# EAGLE design reverb (EAGLE 7.5.0)

## Sheet 1 of 3: Power
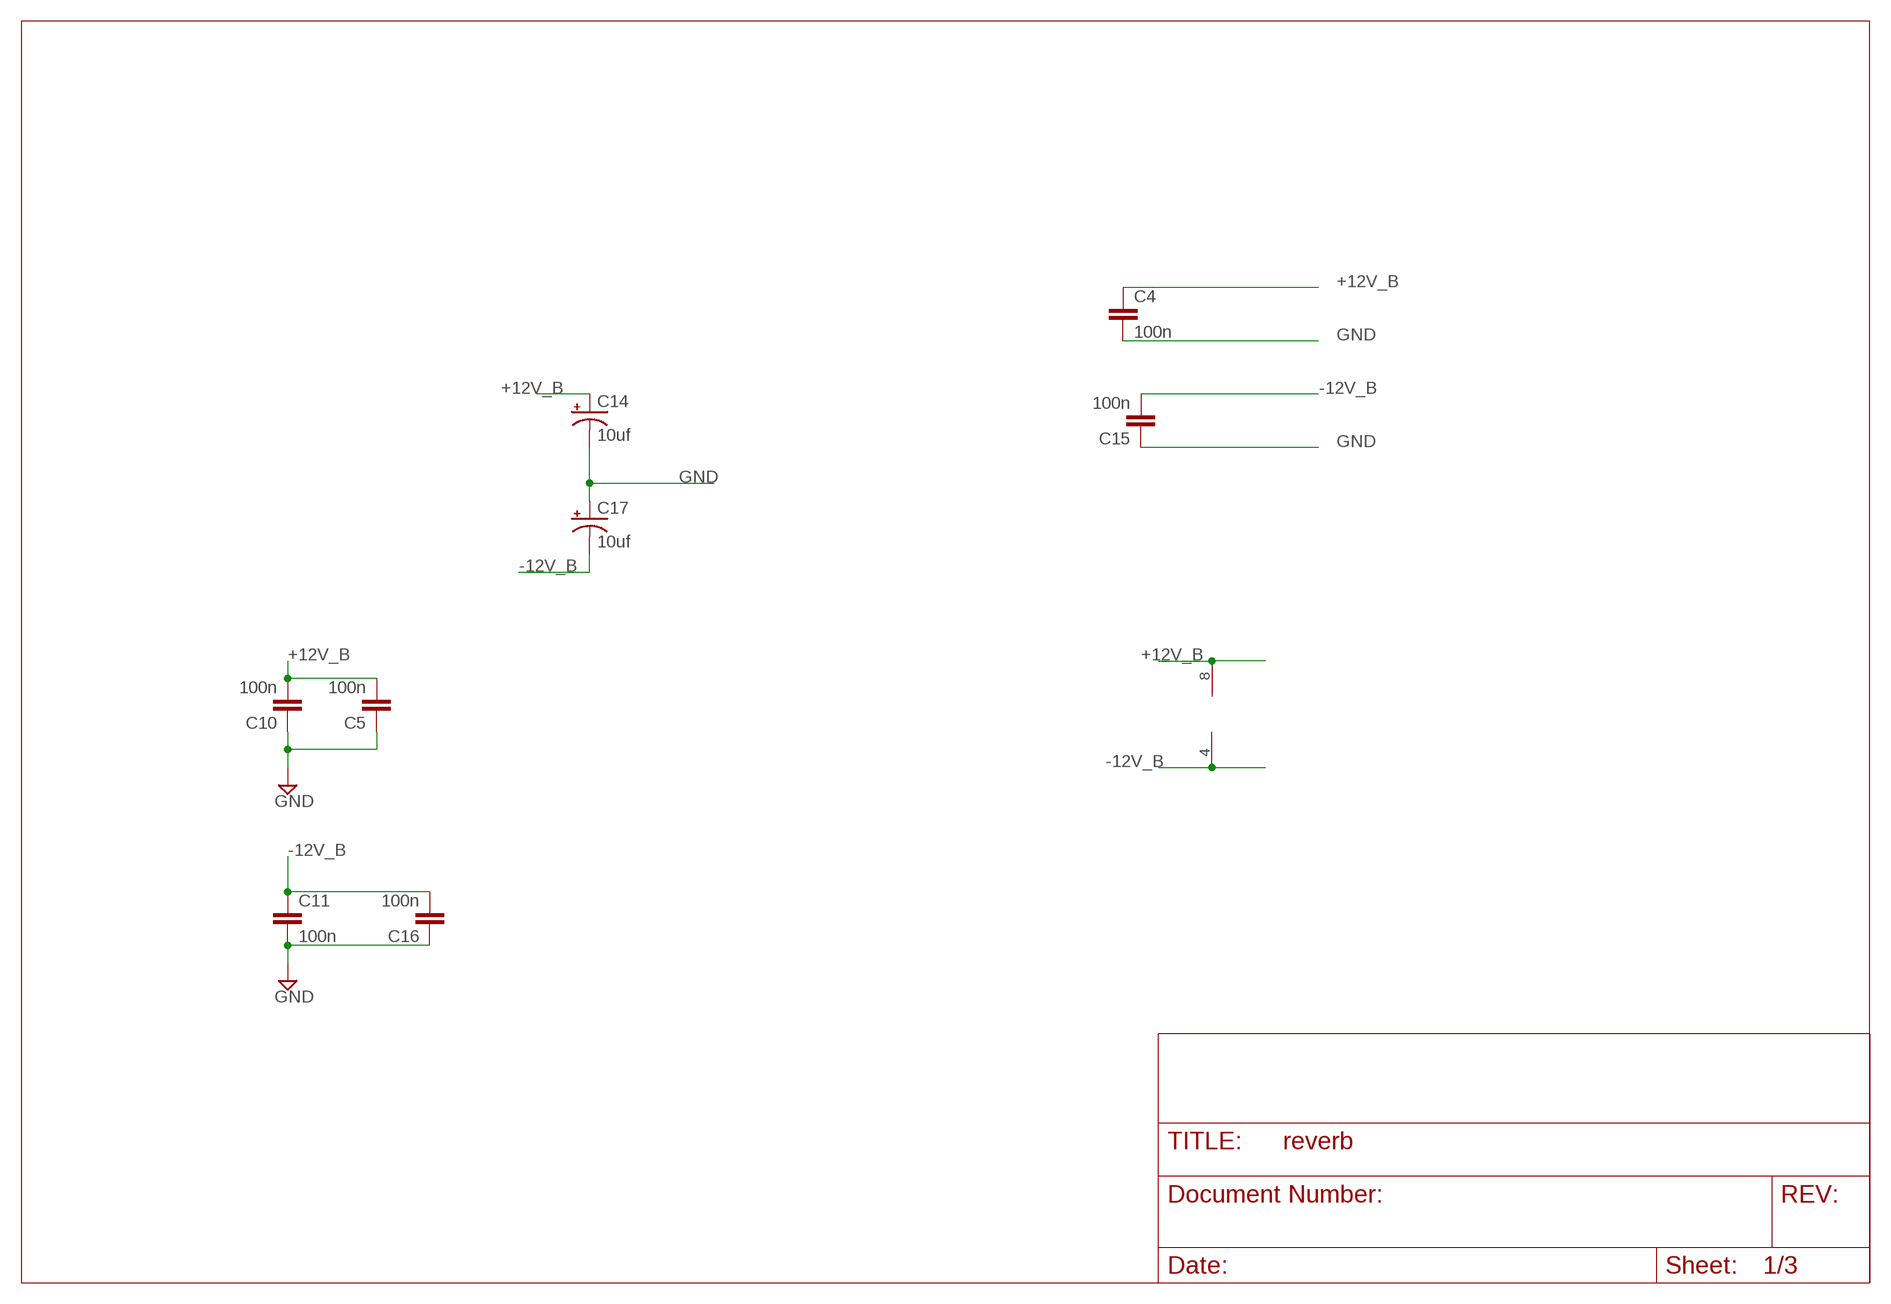
[diagram p0: schematic, sheet 1]

### Parts
C4  100n  C-EU050-024X044  [C050-024X044]
C5  100n  C-EU050-024X044  [C050-024X044]
C10  100n  C-EU050-024X044  [C050-024X044]
C11  100n  C-EU050-024X044  [C050-024X044]
C14  10uf  CAP_POLPTH2  [CPOL-RADIAL-10UF-25V]
C15  100n  C-EU050-024X044  [C050-024X044]
C16  100n  C-EU050-024X044  [C050-024X044]
C17  10uf  CAP_POLPTH2  [CPOL-RADIAL-10UF-25V]
IC4_DRV_RCVR  TL072  TL072P  [DIL08]

### Nets
+12V_B [power]: C4.1 C5.2 C10.2 C14.1(+) IC4_DRV_RCVR.8(P:V+) ; also sheet 2,3
-12V_B [power]: C11.1 C15.2 C16.2 C17.2(-) IC4_DRV_RCVR.4(P:V-) ; also sheet 2,3
GND [ground]: C4.2 C5.1 C10.1 C11.2 C14.2(-) C15.1 C16.1 C17.1(+) ; also sheet 2,3

## Sheet 2 of 3
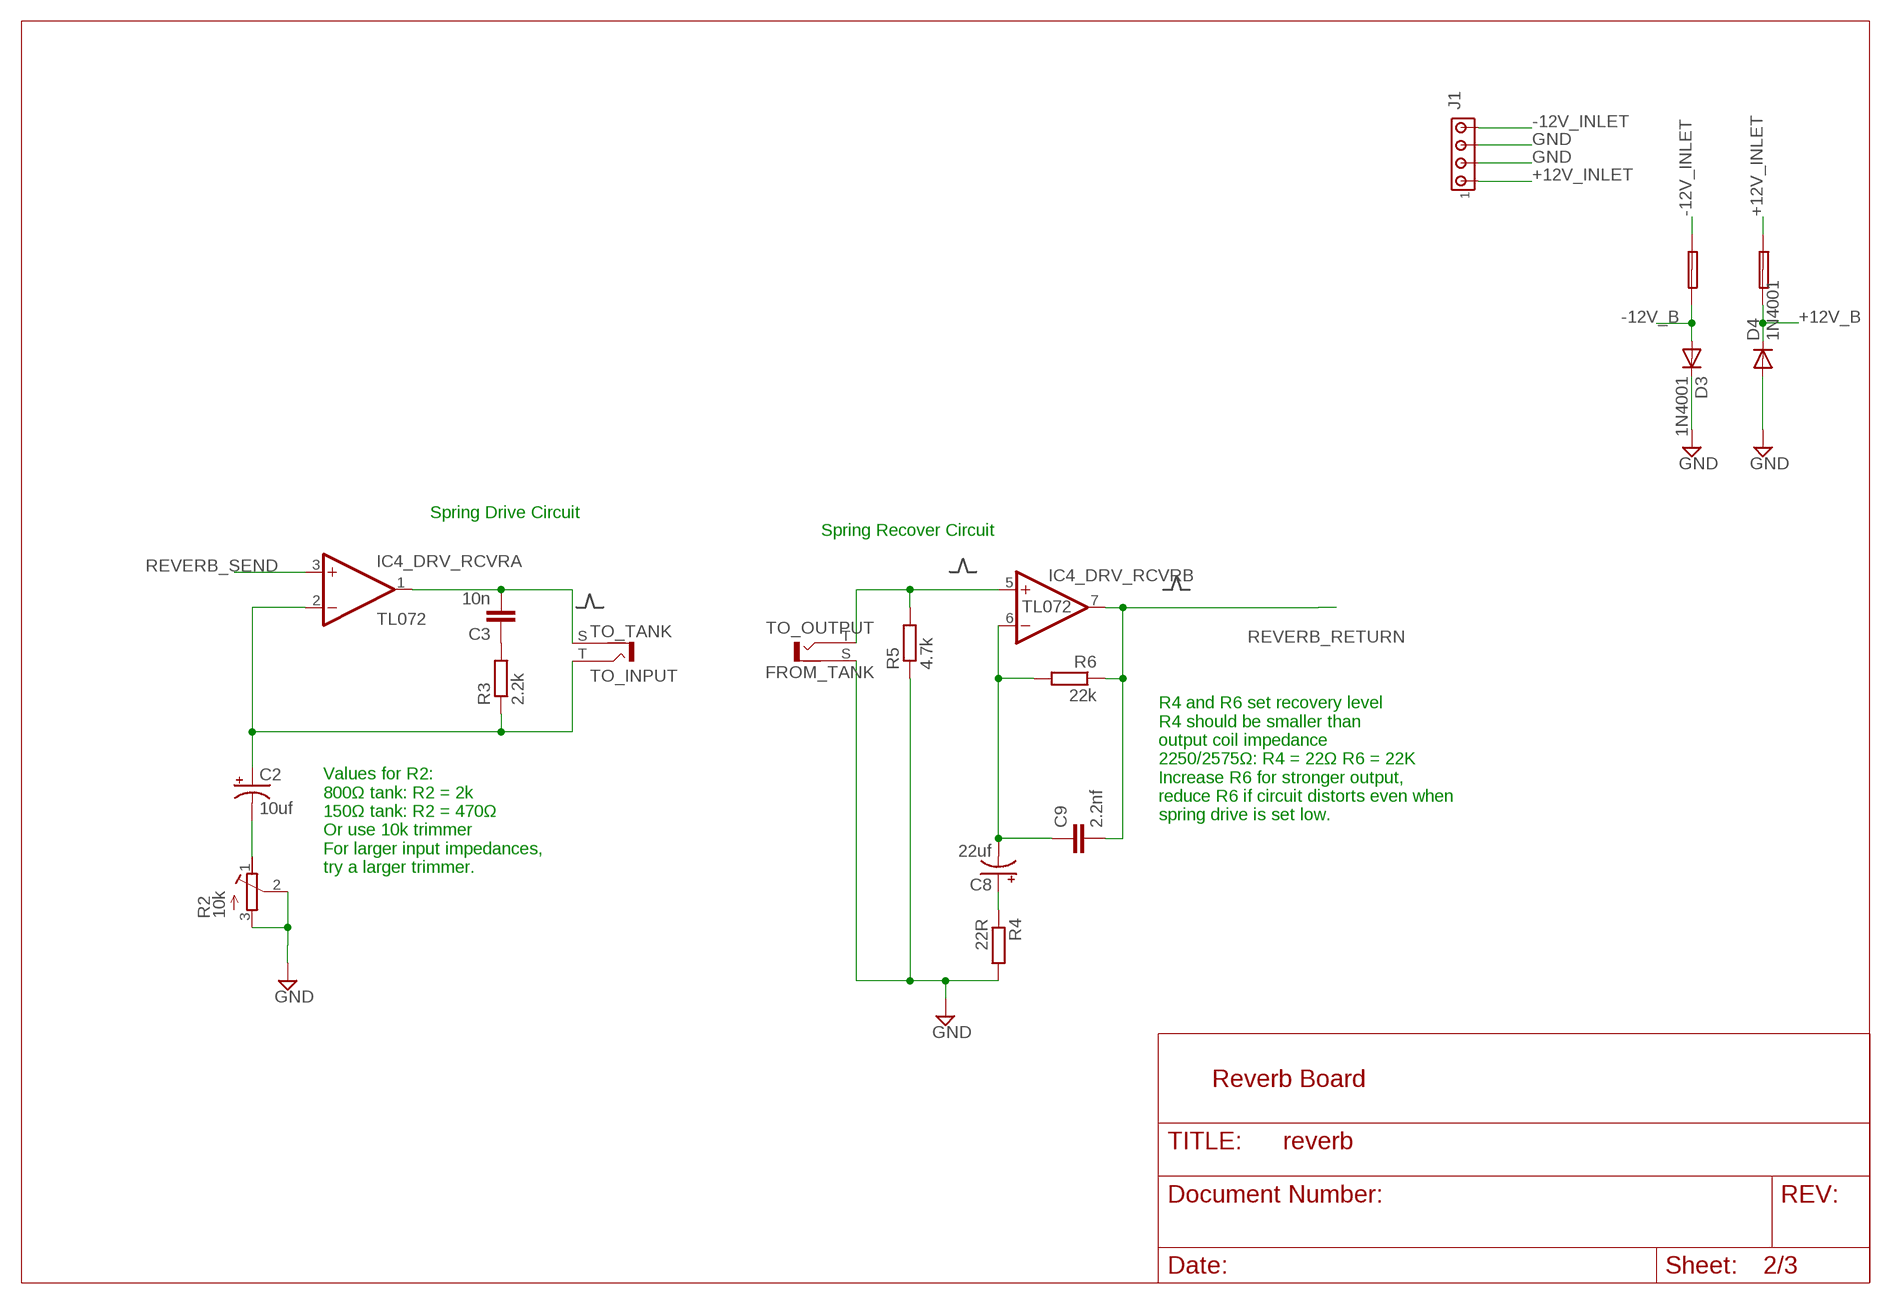
[diagram p1: schematic, sheet 2]

### Parts
0.1A_FUSE  FUSE  PTC_FUSEPOLY_FUSE  [C050H075X075]
0.1A_FUSE_2  FUSE  PTC_FUSEPOLY_FUSE  [C050H075X075]
C2  10uf  CAP_POLPTH2  [CPOL-RADIAL-10UF-25V]
C3  10n  C-EU050-024X044  [C050-024X044]
C8  22uf  CAP_POLPTH2  [CPOL-RADIAL-10UF-25V]
C9  2.2nf  C-EU050-024X044  [C050-024X044]
D3  1N4001  1N4004  [DO41-10]
D4  1N4001  1N4004  [DO41-10]
J1  MTA04-156  [1X4MTA]
R2  10k  R-TRIMMT93YA  [RTRIMT93YA]
R3  2.2k  R-EU_STANDARD_RESISTOR  [0207/10]
R4  22R  R-EU_STANDARD_RESISTOR  [0207/10]
R5  4.7k  R-EU_STANDARD_RESISTOR  [0207/10]
R6  22k  R-EU_STANDARD_RESISTOR  [0207/10]
TO_INPUT  TO_TANK  BTOR1  [BTOR1]
TO_OUTPUT  FROM_TANK  BTOR1  [BTOR1]

### Nets
+12V_B [power]: 0.1A_FUSE_2.1 D4.C ; also sheet 1,3
+12V_INLET: 0.1A_FUSE_2.2 J1.1
-12V_B [power]: 0.1A_FUSE.1 D3.A ; also sheet 1,3
-12V_INLET: 0.1A_FUSE.2 J1.4
GND [ground]: D3.C D4.A J1.2 J1.3 R2.2(S) R2.3(E) R4.2 R5.1 TO_OUTPUT.S ; also sheet 1,3
N$1: C2.2(-) R2.1(A)
N$2: C3.1 R3.2
N$4: C3.2 IC4_DRV_RCVR.1(A:OUT) TO_INPUT.S
N$5: C2.1(+) IC4_DRV_RCVR.2(A:-IN) R3.1 TO_INPUT.T
N$7: IC4_DRV_RCVR.5(B:+IN) R5.2 TO_OUTPUT.T
N$8: C8.1(+) R4.1
N$9: C8.2(-) C9.1 IC4_DRV_RCVR.6(B:-IN) R6.2
REVERB_RETURN: C9.2 IC4_DRV_RCVR.7(B:OUT) R6.1 ; also sheet 3
REVERB_SEND: IC4_DRV_RCVR.3(A:+IN) ; also sheet 3
Unconnected: TO_INPUT.S@1 TO_INPUT.S@2 TO_INPUT.S@3 TO_OUTPUT.S@1 TO_OUTPUT.S@2 TO_OUTPUT.S@3

### Notes on the sheet
- Spring Drive Circuit
- Spring Recover Circuit
- Values for R2:
  800Ω tank: R2 = 2k
  150Ω tank: R2 = 470Ω
  Or use 10k trimmer
  For larger input impedances, 
  try a larger trimmer.
- R4 and R6 set recovery level 
  R4 should be smaller than 
  output coil impedance
  2250/2575Ω: R4 = 22Ω R6 = 22K 
  Increase R6 for stronger output, 
  reduce R6 if circuit distorts even when 
  spring drive is set low.
- Reverb Board

## Sheet 3 of 3
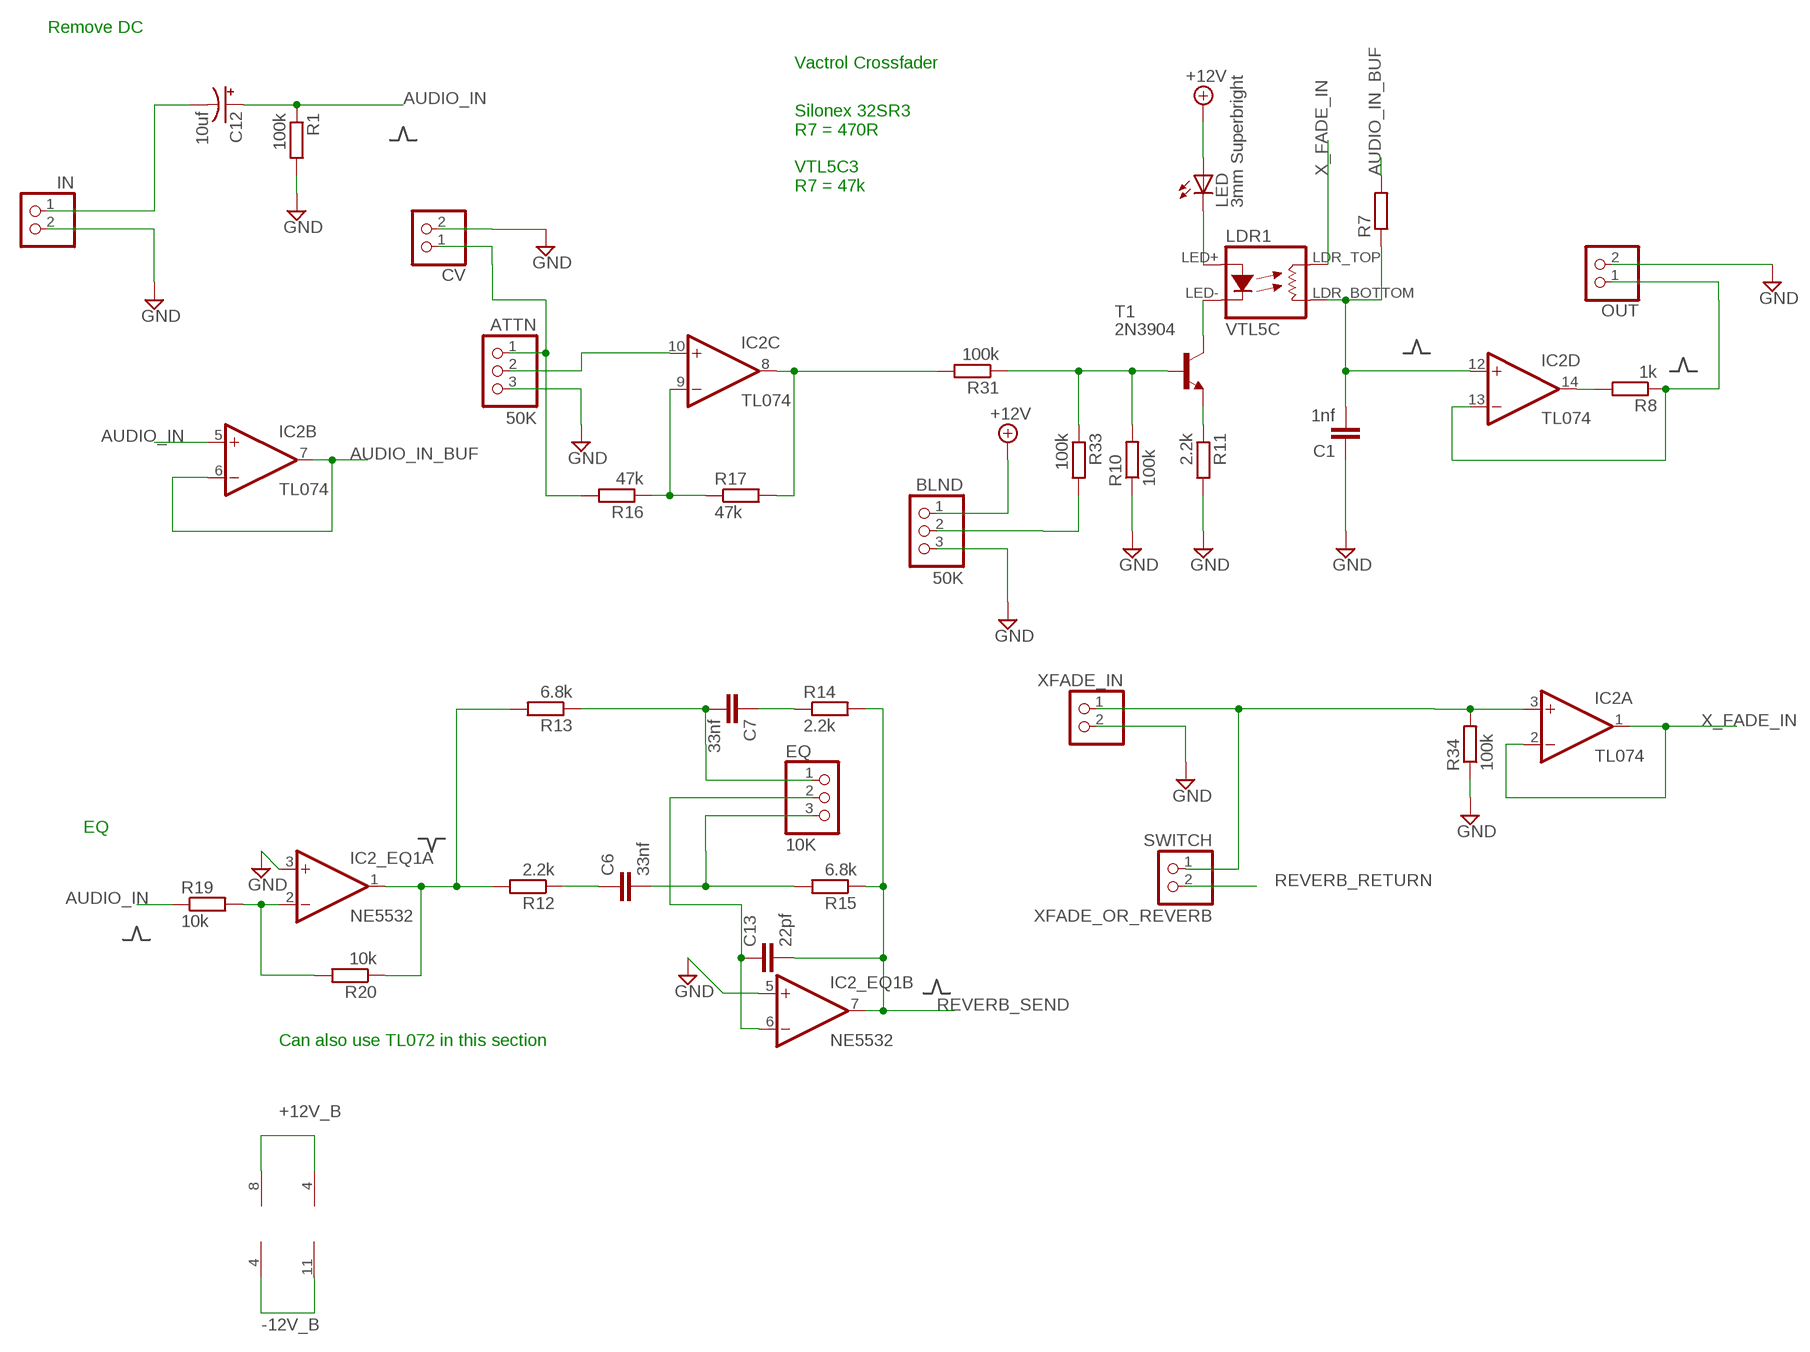
[diagram p2: schematic, sheet 3]

### Parts
ATTN  50K  PINHD-1X3  [1X03]
BLND  50K  PINHD-1X3  [1X03]
C1  1nf  C-EU050-024X044  [C050-024X044]
C6  33nf  C-EU050-024X044  [C050-024X044]
C7  33nf  C-EU050-024X044  [C050-024X044]
C12  10uf  050  [050_020]
C13  22pf  050X030_0251  [050X030_025]
CV  PINHD-1X2  [1X02]
EQ  10K  PINHD-1X3  [1X03]
IC2  TL074  TL074P  [DIL14]
IC2_EQ1  NE5532  TL072P  [DIL08]
IN  PINHD-1X2  [1X02]
LDR1  VTL5C  VACTROL_COMPACT  [VACTROL_COMPACT]
LED  3mm Superbright  LED3MM  [LED3MM]
OUT  PINHD-1X2  [1X02]
R1  100k  VERT-RESIST1  [VERT-RESISTOR]
R7  R-EU_STANDARD_RESISTOR  [0207/10]
R8  1k  R-EU_STANDARD_RESISTOR  [0207/10]
R10  100k  R-EU_STANDARD_RESISTOR  [0207/10]
R11  2.2k  R-EU_STANDARD_RESISTOR  [0207/10]
R12  2.2k  R-EU_STANDARD_RESISTOR  [0207/10]
R13  6.8k  R-EU_STANDARD_RESISTOR  [0207/10]
R14  2.2k  R-EU_STANDARD_RESISTOR  [0207/10]
R15  6.8k  R-EU_STANDARD_RESISTOR  [0207/10]
R16  47k  VERT-RESIST1  [VERT-RESISTOR]
R17  47k  VERT-RESIST1  [VERT-RESISTOR]
R19  10k  VERT-RESIST1  [VERT-RESISTOR]
R20  10k  R-EU_STANDARD_RESISTOR  [0207/10]
R31  100k  R-EU_STANDARD_RESISTOR  [0207/10]
R33  100k  R-EU_STANDARD_RESISTOR  [0207/10]
R34  100k  R-EU_STANDARD_RESISTOR  [0207/10]
SWITCH  XFADE_OR_REVERB  PINHD-1X2  [1X02]
T1  2N3904  [TO92]
XFADE_IN  PINHD-1X2  [1X02]

### Nets
+12V [power]: BLND.1 LED.A
+12V_B [power]: IC2.4(P:V+) IC2_EQ1.8(P:V+) ; also sheet 1,2
-12V_B [power]: IC2.11(P:V-) IC2_EQ1.4(P:V-) ; also sheet 1,2
AUDIO_IN: C12.+ IC2.5(B:+IN) R1.1 R19.1
AUDIO_IN_BUF: IC2.6(B:-IN) IC2.7(B:OUT) R7.2
GND [ground]: ATTN.3 BLND.3 C1.1 CV.2 IC2_EQ1.3(A:+IN) IC2_EQ1.5(B:+IN) IN.2 OUT.2 R1.2 R10.1 R11.2 R34.1 XFADE_IN.2 ; also sheet 1,2
MIX_OUT_B: IC2.13(D:-IN) OUT.1 R8.1
N$3: C12.- IN.1
N$6: IC2.3(A:+IN) R34.2 SWITCH.1 XFADE_IN.1
N$10: ATTN.1 CV.1 R16.2
N$13: C6.1 R12.1
N$14: BLND.2 R33.2
N$15: IC2.14(D:OUT) R8.2
N$16: C6.2 EQ.3 R15.2
N$17: R11.1 T1.3(E)
N$18: C7.2 EQ.1 R13.1
N$20: ATTN.2 IC2.10(C:+IN)
N$21: C7.1 R14.1
N$22: C13.1 EQ.2 IC2_EQ1.6(B:-IN)
N$23: IC2.9(C:-IN) R16.1 R17.1
N$24: IC2_EQ1.2(A:-IN) R19.2 R20.2
N$25: IC2.8(C:OUT) R17.2 R31.2
N$26: LDR1.LED+ LED.K(C)
N$31: IC2_EQ1.1(A:OUT) R12.2 R13.2 R20.1
N$36: R10.2 R31.1 R33.1 T1.2(B)
N$37: LDR1.LED- T1.1(C)
REVERB_RETURN: SWITCH.2 ; also sheet 2
REVERB_SEND: C13.2 IC2_EQ1.7(B:OUT) R14.2 R15.1 ; also sheet 2
SUM: C1.2 IC2.12(D:+IN) LDR1.LDR_BOTTOM(RES2) R7.1
X_FADE_IN: IC2.1(A:OUT) IC2.2(A:-IN) LDR1.LDR_TOP(RES1)

### Notes on the sheet
- Remove DC
- Vactrol Crossfader
- Silonex 32SR3 
  R7 = 470R
  
  VTL5C3 
  R7 = 47k
- EQ
- Can also use TL072 in this section

## Library data of the parts
0.1A_FUSE 0.1A_FUSE_2 = TomW:PTC_FUSE
ATTN BLND EQ = pinhead:PINHD-1X3: PIN HEADER
C1 C3-C7 C9-C11 C15 C16 = TomW:C-EU: CAPACITOR, European symbol
C2 C8 C14 C17 = SparkFun-Passives:CAP_POL: Capacitor Polarized These are standard SMD and PTH capacitors. Normally 10uF, 47uF, and 100uF in electrolytic and tantalum varieties. Always verify the external diameter of the through hole cap, it varies with capacity, voltage, and manufacturer. The EIA devices should be standard.
C12 = gm-caps-electro-pol:050: 0.22 - 100uF Xicon values at Mouser.com: 10V: 10 - 100uF; 16V: 2.2 - 47uF; 25V: 0.47 - 47uF; 50V: 0.22 - 22uF
C13 = gm-caps-ceramic:050X030_025: 47 - 120pF Xicon Ceramic Disc 2.5mm lead spacing
CV IN OUT SWITCH XFADE_IN = pinhead:PINHD-1X2: PIN HEADER
D3 D4 = diode:1N4004: DIODE general purpose rectifier, 1 A
IC2 = linear:TL074: OP AMP
IC2_EQ1 IC4_DRV_RCVR = TomW:TL072: OP AMP
J1 = con-amp:MTA04-156: AMP connector
LDR1 = TomW:VACTROL_COMPACT
LED = TomW:LED: LED OSRAM: - CHIPLED LG R971, LG N971, LY N971, LG Q971, LY Q971, LO R971, LY R971 LH N974, LH R974 LS Q976, LO Q976, LY Q976 LO Q996 - Hyper CHIPLED LW Q18S LB Q993, LB Q99A, LB R99A - SideLED LS A670, LO A670, LY A670, LG A670, LP A670 LB A673, LV A673, LT A673, LW A673 LH A674 LY A675 LS A676, LA A676, LO A676, LY A676, LW A676 LS A679, LY A679, LG A679 - Hyper Micro SIDELED® LS Y876, LA Y876, LO Y876, LY Y876 LT Y87S - SmartLED LW L88C, LW L88S LB L89C, LB L89S, LG L890 LS L89K, LO L89K, LY L89K LS L896, LA L896, LO L896, LY L896 - TOPLED LS T670, LO T670, LY T670, LG T670, LP T670 LSG T670, LSP T670, LSY T670, LOP T670, LYG T670 LG T671, LOG T671, LSG T671 LB T673, LV T673, LT T673, LW T673 LH T674 LS T676, LA T676, LO T676, LY T676, LB T676, LH T676, LSB T676, LW T676 LB T67C, LV T67C, LT T67C, LS T67K, LO T67K, LY T67K, LW E67C LS E67B, LA E67B, LO E67B, LY E67B, LB E67C, LV E67C, LT E67C LW T67C LS T679, LY T679, LG T679 LS T770, LO T770, LY T770, LG T770, LP T770 LB T773, LV T773, LT T773, LW T773 LH T774 LS E675, LA E675, LY E675, LS T675 LS T776, LA T776, LO T776, LY T776, LB T776 LHGB T686 LT T68C, LB T68C - Hyper Mini TOPLED® LB M676 - Mini TOPLED Santana® LG M470 LS M47K, LO M47K, LY M47K Source: http://www.osram.convergy.de LUXEON: - LUMILED® LXK2-PW12-R00, LXK2-PW12-S00, LXK2-PW14-U00, LXK2-PW14-V00 LXK2-PM12-R00, LXK2-PM12-S00, LXK2-PM14-U00 LXK2-PE12-Q00, LXK2-PE12-R00, LXK2-PE12-S00, LXK2-PE14-T00, LXK2-PE14-U00 LXK2-PB12-K00, LXK2-PB12-L00, LXK2-PB12-M00, LXK2-PB14-N00, LXK2-PB14-P00, LXK2-PB14-Q00 LXK2-PR12-L00, LXK2-PR12-M00, LXK2-PR14-Q00, LXK2-PR14-R00 LXK2-PD12-Q00, LXK2-PD12-R00, LXK2-PD12-S00 LXK2-PH12-R00, LXK2-PH12-S00 LXK2-PL12-P00, LXK2-PL12-Q00, LXK2-PL12-R00 Source: www.luxeon.com KINGBRIGHT: KA-3528ASYC Source: www.kingbright.com
R1 R16 R17 R19 = TomW:VERT-RESIST1: Vertical resistor
R2 = resistor:R-TRIMM: Trimm resistor
R3-R8 R10-R15 R20 R31 R33 R34 = TomW:R-EU_: RESISTOR, European symbol
T1 = transistor:2N3904: NPN TRANSISTOR
TO_INPUT TO_OUTPUT = con-lumberg:BTOR1: RCA connectors according to JEITA RC-5231 Cinch RCA-Einbaukupplung nach JEITA RC-5231, stehende Ausführung Source: http://www.lumberg.de/Produkte/PDFs/BTOR1.pdf; MPN: BTOR 1; OC_FARNELL: 1217030; OC_NEWARK: 96K7172

## Net classes
0 default: width 0.406 mm
1 power: width 0.61 mm
2 ground: width 0.61 mm

## Board
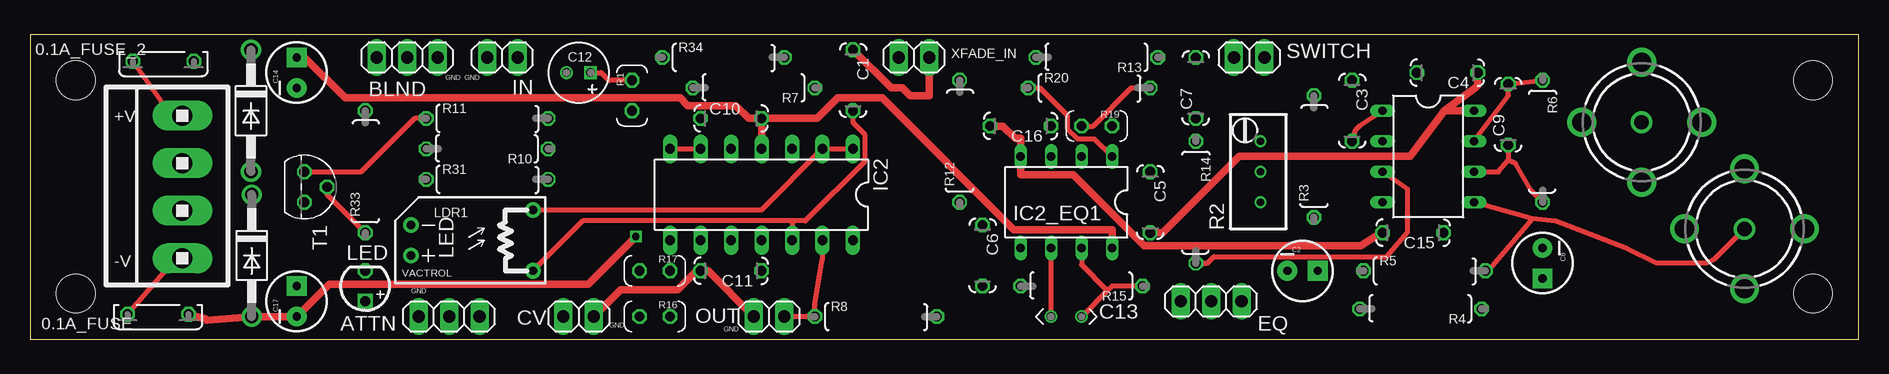
[diagram p3: board, top side]
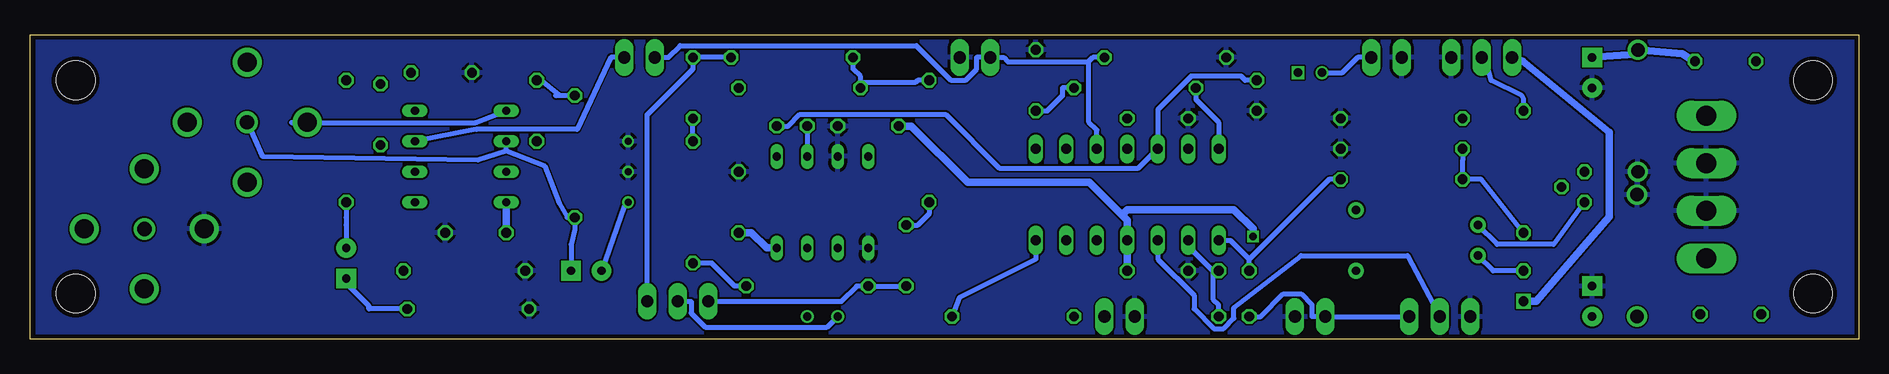
[diagram p4: board, bottom side, seen from below]

Size 152.4 x 25.4 mm. Coordinates in mm from the lower left corner, seen from the top.
Outline: 0,0 152.4,0 152.4,25.4 0,25.4 0,0
Copper layers (1*16): Top 0.0356mm / dielectric 1.5011mm / Bottom 0.0356mm
Design rules "LaenPCBOrder": minimum track width 6mil, minimum drill 13mil, track to track 6mil, track to pad 6mil, pad to pad 6mil, via to via 6mil, smd to smd 6mil, copper to edge 15mil, drill to drill 6mil, minimum pad ring 7mil, minimum via ring 7mil, stop-mask expansion 3mil, vias tented up to drill 0mil, thermal gap 10mil
Holes 3.2 mm at 3.81,3.81 3.81,21.59 148.59,21.59 148.59,3.81

### Footprints (pad centres in the part's own frame; a part is rotated, then mirrored left to right if it is on the bottom)
C050H075X075 = drill 0.813 octagon: 1 -2.54,0; 2 2.54,0
1X03 = drill 1.016 long: 1 -2.54,0; 2 0,0; 3 2.54,0
C050-024X044 = drill 0.813 octagon: 1 -2.54,0; 2 2.54,0
CPOL-RADIAL-10UF-25V = drill 0.7 pad 1.651 square: 1 1.27,0 | drill 0.7 pad 1.651: 2 -1.27,0
050_020 = drill 0.7 square: + -1,0 | drill 0.7: - 1,0
050X030_025 = drill 0.7: 1 -1.27,0; 2 1.27,0
1X02 = drill 1.016 long: 1 -1.27,0; 2 1.27,0
DO41-10 = drill 1.118: A 5.08,0; C -5.08,0
DIL14 = drill 0.813 long: 1 -7.62,-3.81; 2 -5.08,-3.81; 3 -2.54,-3.81; 4 0,-3.81; 5 2.54,-3.81; 6 5.08,-3.81; 7 7.62,-3.81; 8 7.62,3.81; 9 5.08,3.81; 10 2.54,3.81; 11 0,3.81; 12 -2.54,3.81; 13 -5.08,3.81; 14 -7.62,3.81
DIL08 = drill 0.7 long: 1 -3.81,-3.81; 2 -1.27,-3.81; 3 1.27,-3.81; 4 3.81,-3.81; 5 3.81,3.81; 6 1.27,3.81; 7 -1.27,3.81; 8 -3.81,3.81
1X4MTA = drill 1.676 long: 1 5.944,0; 2 1.981,0; 3 -1.981,0; 4 -5.944,0
VACTROL_COMPACT = drill 0.7 pad 1.3: LDR_BOTTOM 5.08,-2.54; LDR_TOP 5.08,2.54; LED+ -5.08,-1.27; LED- -5.08,1.27
LED3MM = drill 0.813 square: A -1.27,0 | drill 0.813 octagon: K 1.27,0
VERT-RESISTOR = drill 0.813 octagon: 1 -1.27,0; 2 1.27,0
RTRIMT93YA = drill 0.61: 1 0,-2.54; 2 0,0; 3 0,2.54
0207/10 = drill 0.813 octagon: 1 -5.08,0; 2 5.08,0
TO92 = drill 0.813 octagon: 1 1.27,0; 2 0,1.905; 3 -1.27,0
BTOR1 = drill 1.6 pad 2.2: S -5,0; S@1 0,5; S@2 5,0; S@3 0,-5 | drill 1.2 pad 1.6: T 0,0

### Placement (x,y rotation side)
0.1A_FUSE  10.67,2.1 180 top
0.1A_FUSE_2  11.11,23.18 180 top
ATTN  34.92,1.91 180 top
BLND  31.43,23.5 0 top
C1  68.58,21.59 270 top
C2  106.05,5.71 0 top
C3  110.17,19.05 270 top
C4  118.11,22.23 180 top
C5  93.34,11.43 270 top
C6  79.38,6.99 270 top
C7  97.16,20.95 90 top
C8  126.05,6.35 270 top
C9  123.19,18.73 90 top
C10  58.42,18.41 0 top
C11  58.42,5.71 180 top
C12  45.72,22.23 180 top
C13  86.36,1.91 0 top
C14  22.23,22.23 90 top
C15  115.25,8.89 180 top
C16  82.55,17.78 180 top
C17  22.23,3.17 90 top
CV  45.72,1.91 0 top
D3  18.48,6.99 270 top
D4  18.41,19.05 270 top
EQ  98.42,3.17 180 top
IC2  60.96,12.06 180 top
IC2_EQ1  86.36,11.43 180 top
IC4_DRV_RCVR  116.52,15.24 270 top
IN  39.37,23.5 180 top
J1  12.7,12.7 90 top
LDR1  36.83,8.26 0 top
LED  27.94,4.45 90 top
OUT  61.59,1.91 180 top
R1  50.16,20.32 270 top
R2  102.55,13.97 0 top
R3  107,15.24 90 top
R4  115.89,2.54 180 top
R5  116.2,5.71 0 top
R6  126.05,16.51 270 top
R7  60.33,20.95 180 top
R8  70.48,1.91 0 top
R10  38.1,15.88 180 top
R11  38.1,18.41 0 top
R12  77.47,16.51 90 top
R13  88.9,23.5 180 top
R14  97.16,11.43 270 top
R15  87.63,4.45 180 top
R16  52.07,1.91 180 top
R17  52.07,5.71 180 top
R19  88.9,17.78 180 top
R20  88.27,20.95 0 top
R31  38.1,13.34 0 top
R33  27.94,13.97 90 top
R34  57.78,23.5 0 top
SWITCH  101.6,23.5 0 top
T1  22.86,12.7 270 top
TO_INPUT  134.3,18.1 0 top
TO_OUTPUT  142.88,9.21 0 top
XFADE_IN  73.66,23.5 0 top

### Tracks (layer width: path | path; a pad name or v marks a point on that pad's centre or on a via)
+12V
  Bottom 0.61: BLND.1 27.99,23.18 20.79,17.24 20.79,10.21 26.87,3.17 LED.A
+12V_B
  Top 0.61: IC2_EQ1.8 90.17,9.13 82,9.13 71,20.13 67.31,20.13 65.6,18.41 C10.2 | C14.1 22.87,23.5 26.25,20.12 54.18,20.12 54.81,19.48 58.83,19.48 59.89,18.41 C10.2 | C10.2 60.96,17.55 IC2.4 | C5.2 94.41,8.89 100.76,15.24 115.01,15.24 117.87,19.05 | C4.1 120.65,21.16 120.41,20.91 117.87,19.05 | IC4_DRV_RCVR.8 117.87,19.05
  Bottom 0.61: C14.1 18.1,23.81 D4.C 14.72,23.81 13.77,23.18 0.1A_FUSE_2.1 | C5.2 92.28,8.89 91.01,7.62 IC2_EQ1.8
+12V_INLET
  Top 0.406: 0.1A_FUSE_2.2 11.73,18.73 11.82,18.64 J1.1
-12V_B  (via drill 0.6)
  Top 0.61: C15.2 112.6,8.89 110.88,7.81 92.86,7.81 86.94,13.73 82.55,13.73 IC2_EQ1.4 82.55,16.75 82.1,16.75 81.08,17.78 C16.2 | 0.1A_FUSE.1 14.59,1.71 14.72,1.59 D3.A C17.2 24.92,4.6 46.51,4.6 v50.48,8.57
  Bottom 0.61: C16.2 78.94,17.78 74.25,13.09 64.12,13.09 61.39,10.36 | 61.39,10.36 60.96,9.93 IC2.11 C11.1 | IC4_DRV_RCVR.4 C15.2 | v50.48,8.57 50.48,9.21 52.07,10.79 60.96,10.79 61.39,10.36
-12V_INLET
  Top 0.406: 0.1A_FUSE.2 12.24,6.79 12.52,6.76 J1.4
AUDIO_IN
  Top 0.406: C12.+ 47.6,22.23 48.24,21.59 R1.1
  Bottom 0.406: R1.1 51.13,21.59 51.48,21.94 55.63,21.94 58.42,19.15 IC2.5 60.03,14.27 71.62,14.27 76.09,18.75 88.24,18.75 89.2,17.78 R19.1
AUDIO_IN_BUF
  Top 0.406: IC2.7 IC2.6
  Bottom 0.406: R7.2 55.24,19.99 53.34,18.09 IC2.7
GND
  Top 0.61: OUT.2 56.52,5.71 C11.2 55.56,5.71 53.98,4.13 49.21,4.13 CV.2 | XFADE_IN.2 74.93,20.32 73.34,20.32 72.71,20.95 71.75,20.95 C1.1
  pour Bottom: 0.32,25.08 151.76,25.08 151.76,0.32 0.32,0.32
MIX_OUT_B
  Top 0.406: IC2.13 66.04,6.68 | 66.04,6.68 65.41,2.87 R8.1 OUT.1 | 66.04,6.68
N$1
  Bottom 0.406: R2.1 102.87,11.11 C2.2
N$2
  Bottom 0.406: R3.2 108.6,20.32 108.28,20.35 109.84,21.59 C3.1
N$3
  Bottom 0.406: IN.1 41.76,23.5 43.03,22.23 C12.-
N$4
  Top 0.406: C3.2 110.49,17.48 110.82,17.79 IC4_DRV_RCVR.1
  Bottom 0.406: TO_INPUT.S 130.6,18.07 115.28,18.07 IC4_DRV_RCVR.1
N$5
  Bottom 0.406: 112.71,15.73 109.51,14.46 108.28,11.33 107.64,10.16 R3.1 107,9.2 107.31,7.92 C2.1 | TO_INPUT.T 133.06,15.27 115.08,14.95 112.71,15.73 | 112.71,15.73 IC4_DRV_RCVR.2
N$6
  Bottom 0.406: SWITCH.1 99.21,23.5 98.23,24.48 78.53,24.48 75.66,21.61 74.42,21.61 73.51,22.52 73.51,23.5 XFADE_IN.1 71.27,23.5 70.9,23.13 64.2,23.13 | IC2.3 63.5,17.45 64.2,18.15 64.2,23.13 | 64.2,23.13 63.83,23.5 R34.2
N$7
  Top 0.406: 125.2,10.05 121.61,5.84 121.61,5.71 R5.2 | TO_OUTPUT.T 142.57,8.87 140.34,6.67 139.7,6.35 135.57,6.35 133.03,7.6 127.19,9.83 125.2,10.05 | 125.2,10.05 IC4_DRV_RCVR.5
N$8
  Bottom 0.406: R4.1 124.16,2.54 124.16,2.78 126.45,5.08 C8.1
N$9
  Top 0.406: R6.2 125.09,12.39 123.83,14.62 123.19,14.91 | C9.1 123.19,14.91 | IC4_DRV_RCVR.6 122.38,13.97 122.37,13.96 123.19,14.91
  Bottom 0.406: R6.2 126.05,10.15 126.05,9.51 C8.2
N$10
  Bottom 0.406: R16.2 49.84,1.91 47.95,3.79 46.47,3.79 45.57,2.88 45.57,1.91 CV.1 ATTN.1
N$13
  Bottom 0.406: C6.1 78.41,9.53 77.47,10.46 R12.1
N$14
  Bottom 0.406: BLND.2 30.95,22.86 30.63,21.59 28.11,20.33 27.94,20.02 R33.2
N$15
  Bottom 0.406: IC2.14 68.58,6.68 | R8.2 74.93,3.5 68.58,6.68 | 68.58,6.68
N$16
  Bottom 0.406: EQ.3 84.78,3.17 83.52,4.45 R15.2 C6.2
N$17
  Top 0.406: R11.1 32.05,18.41 27.61,13.97 T1.3
N$18
  Bottom 0.406: EQ.1 100.97,18.72 97.16,22.53 C7.2 R13.1
N$20
  Bottom 0.406: ATTN.2 35.41,1.91 35.41,2.88 37.6,6.98 46.48,6.98 52.07,2.65 52.07,1.76 52.93,0.9 53.75,0.9 55.4,2.55 55.4,3.66 58.42,6.68 IC2.10
N$21
  Bottom 0.406: R14.1 C7.1
N$22
  Top 0.406: C13.1 IC2_EQ1.6
  Bottom 0.406: EQ.2 97.31,3.17 97.31,2.2 96.12,1.01 85.98,1.01 C13.1
N$23
  Bottom 0.406: 53.82,5.71 55.88,7.77 IC2.9 | 53.82,5.71 53.82,3.35 53.34,2.87 R16.1 | R17.1 53.82,5.71
N$24
  Top 0.406: R20.2 92.38,20.95 91.77,20.95 88.59,17.78 R19.2
  Bottom 0.406: R19.2 IC2_EQ1.2
N$25
  Bottom 0.406: IC2.8 52.38,8.26 50.8,6.68 | 50.8,6.68 44.15,13.34 R31.2 | R17.2 50.8,6.68
N$26
  Bottom 0.406: LED.K 30.48,5.71 LDR1.LED+
N$31
  Top 0.406: R20.1 84.15,20.95 86.44,18.66 86.44,17.57 87.3,16.72 88.69,16.72 IC2_EQ1.1
  Bottom 0.406: R12.2 78.44,21.59 78.59,21.44 83.19,21.44 | 83.19,21.44 83.19,21.92 83.79,22.53 83.82,22.53 R13.2 | R20.1 83.19,21.44
N$36
  Top 0.406: T1.2 24.77,12.06 R33.1
  Bottom 0.406: R33.1 27.95,8.89 31.45,13.34 R31.1 33.02,14.91 R10.2
N$37
  Bottom 0.406: T1.1 22.87,11.43 25.44,7.91 30.14,7.91 LDR1.LED-
REVERB_RETURN
  Top 0.406: R6.1 126.03,21.59 C9.2 123.19,20.32 IC4_DRV_RCVR.7
  Bottom 0.406: SWITCH.2 103.99,23.5 106.8,17.51 115.21,17.51 IC4_DRV_RCVR.7
REVERB_SEND
  Top 0.406: R14.2 98.12,6.35 98.67,6.9 113.07,6.9 114.8,8.94 114.8,12.52 IC4_DRV_RCVR.3 | 89.78,4.06 C13.2 | R15.1 90.17,4.45 89.78,4.06 | 89.78,4.06 87.63,6.21 IC2_EQ1.7
  Bottom 0.406: R14.2 95.58,6.35 93.67,4.45 R15.1
SUM
  Top 0.406: 63.5,9.87 IC2.12 | 63.5,9.87 64.61,9.87 69.55,14.81 69.55,17.11 68.58,18.09 C1.2 | 63.5,9.87 | 63.5,9.87 46.06,9.87 LDR1.LDR_BOTTOM
  Bottom 0.406: R7.1 66.37,20.95 66.37,20.29 67.61,19.05 C1.2
X_FADE_IN
  Top 0.406: LDR1.LDR_TOP 60.96,10.79 IC2.2 IC2.1

### Text on the board
tNames: GND | GND | +V | -V | GND | GND | GND